# EAGLE design circuit (EAGLE 9.6.1)
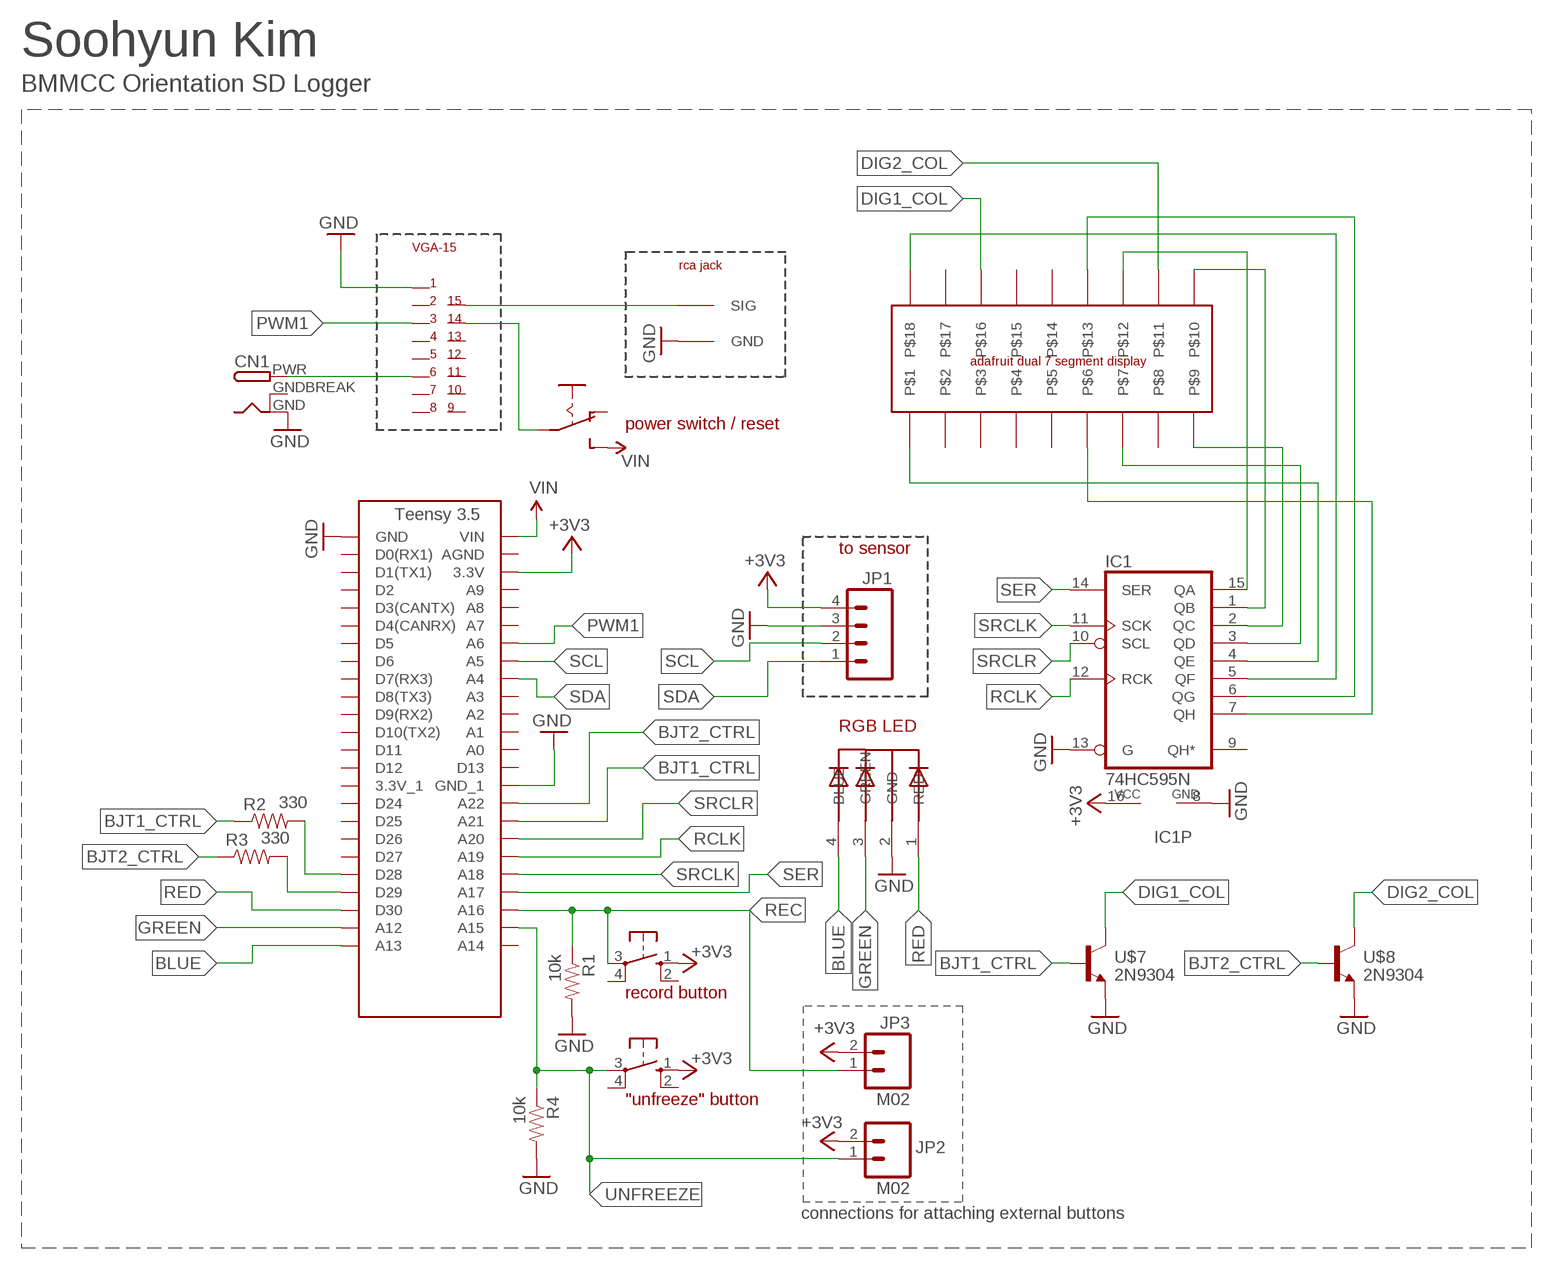
[diagram p0: schematic, sheet 1]

## Parts
CN1  DCBARRELPTH  [DCJACK_2MM_PTH]
IC1  74HC595N  [DIL16]
JP1  M04  [1X04]
JP2  M02  [1X02]
JP3  M02  [1X02]
R1  10k  RESISTORPTH-1/4W  [AXIAL-0.4]
R2  330  RESISTORPTH-1/4W  [AXIAL-0.4]
R3  330  RESISTORPTH-1/4W  [AXIAL-0.4]
R4  10k  RESISTORPTH-1/4W  [AXIAL-0.4]
S3  40-XX  [B3F-40XX]
S4  40-XX  [B3F-40XX]
U$1  TEENSY_3.5  [TEENSY_3.5_SIMPLE]
U$2  VGA-15  [VGA-15]
U$3  RCA  [RCA]
U$4  LED_5MM_RGB  [LED_5MM_RGB]
U$5  SLIDE_SWITCH  [SLIDE_SWITCH]
U$6  DUAL_7SEG_DISPLAY  [DUAL_7SEG_DISPLAY]
U$7  2N9304  [TO92]
U$8  2N9304  [TO92]

## Nets
+3V3: IC1.16(VCC) JP1.4 JP2.2 JP3.2 S3.1(S) S4.1(S) U$1.3.3V
BJT1_CTRL: R2.P$1 U$1.A21 U$7.2(BASE)
BJT2_CTRL: R3.P$1 U$1.A22 U$8.2(BASE)
BLUE: U$1.A13 U$4.4(BLUE)
D28: R2.P$2 U$1.D28
D29: R3.P$2 U$1.D29
DIG1_COL: U$6.16 U$7.1(COLLECTOR)
DIG2_COL: U$6.11 U$8.1(COLLECTOR)
GND: CN1.GND IC1.8(GND) IC1.13(G) JP1.3 R1.P$2 R4.P$2 U$1.GND U$1.GND_1 U$2.1 U$3.GND U$4.2(GND) U$7.3(EMITTER) U$8.3(EMITTER)
GREEN: U$1.A12 U$4.3(GREEN)
N$1: IC1.4(QE) U$6.1
N$2: U$2.14 U$5.P$2(P)
N$3: IC1.1(QB) U$6.10
N$4: IC1.2(QC) U$6.9
N$5: U$2.15 U$3.SIG
N$6: CN1.PWR U$2.6
N$7: IC1.3(QD) U$6.7
N$8: IC1.15(QA) U$6.12
N$9: IC1.5(QF) U$6.18
N$10: IC1.6(QG) U$6.13
N$11: IC1.7(QH) U$6.6
PWM1: U$1.A6 U$2.3
RCLK: IC1.12(RCK) U$1.A19
REC: JP3.1 R1.P$1 S3.3(P) U$1.A16
RED: U$1.D30 U$4.1(RED)
SCL: JP1.2 U$1.A5
SDA: JP1.1 U$1.A4
SER: IC1.14(SER) U$1.A17
SRCLK: IC1.11(SCK) U$1.A18
SRCLR: IC1.10(SCL) U$1.A20
UNFREEZE: JP2.1 R4.P$1 S4.3(P) U$1.A15
VIN: U$1.VIN U$5.P$3(S)
Unconnected: IC1.9(QH*) S3.2(S1) S3.4(P1) S4.2(S1) S4.4(P1) U$1.3.3V_1 U$1.A0 U$1.A1 U$1.A2 U$1.A3 U$1.A7 U$1.A8 U$1.A9 U$1.A14 U$1.AGND U$1.D0(RX1) U$1.D1(TX1) U$1.D2 U$1.D3(CANTX) U$1.D4(CANRX) U$1.D5 U$1.D6 U$1.D7(RX3) U$1.D8(TX3) U$1.D9(RX2) U$1.D10(TX2) U$1.D11 U$1.D12 U$1.D13 U$1.D24 U$1.D25 U$1.D26 U$1.D27 U$2.2 U$2.4 U$2.5 U$2.7 U$2.8 U$2.9 U$2.10 U$2.11 U$2.12 U$2.13 U$5.P$1(O) U$6.2 U$6.3 U$6.4 U$6.5 U$6.8 U$6.14 U$6.15 U$6.17

## Notes on the sheet
- Soohyun Kim
- BMMCC Orientation SD Logger
- power switch / reset
- to sensor
- RGB LED
- record button
- "unfreeze" button
- connections for attaching external buttons

## Power pins joined to a net without a drawn wire
GNDBREAK: CN1.GNDBREAK

## Library data of the parts
CN1 = HyTechDevices:DCBARREL: 2.0mm DC Barrel Jack DCJACK_2MM_PTH - Through Hole Jack (4UConnector: 05537) Source: Adafruit <https://github.com/adafruit/Adafruit-Eagle-Library>
IC1 = 74xx-eu:74*595: 8-bit SHIFT REGISTER, output latch
JP1 = HyTechDevices:M04: Standard 4-pin 0.1" header. NOTES ON THE VARIANTS LOCK and LOCK_LONGPADS... This footprint was designed to help hold the alignment of a through-hole component (i.e. 6-pin header) while soldering it into place. You may notice that each hole has been shifted either up or down by 0.005 of an inch from it's more standard position (which is a perfectly straight line). This slight alteration caused the pins (the squares in the middle) to touch the edges of the holes. Because they are alternating, it causes a "brace" to hold the component in place. 0.005 has proven to be the perfect amount of "off-center" position when using our standard breakaway headers. Although looks a little odd when you look at the bare footprint, once you have a header in there, the alteration is very hard to notice. Also,if you push a header all the way into place, it is covered up entirely on the bottom side. This idea of altering the position of holes to aid alignment will be further integrated into the Sparkfun Library for other footprints. It can help hold any component with 3 or more connection pins. Note: The Sparkfun version includes many other packages including surface mount that may be of future interest. Source: Sparkfun <https://github.com/sparkfun/SparkFun-Eagle-Libraries>
JP2 JP3 = HyTechDevices:M02: Standard 2-pin 0.1" header. NOTES ON THE VARIANTS LOCK and LOCK_LONGPADS... This footprint was designed to help hold the alignment of a through-hole component (i.e. 6-pin header) while soldering it into place. You may notice that each hole has been shifted either up or down by 0.005 of an inch from it's more standard position (which is a perfectly straight line). This slight alteration caused the pins (the squares in the middle) to touch the edges of the holes. Because they are alternating, it causes a "brace" to hold the component in place. 0.005 has proven to be the perfect amount of "off-center" position when using our standard breakaway headers. Although looks a little odd when you look at the bare footprint, once you have a header in there, the alteration is very hard to notice. Also,if you push a header all the way into place, it is covered up entirely on the bottom side. This idea of altering the position of holes to aid alignment will be further integrated into the Sparkfun Library for other footprints. It can help hold any component with 3 or more connection pins. Note: The Sparkfun version includes many other packages including surface mount that may be of future interest. Source: Sparkfun <https://github.com/sparkfun/SparkFun-Eagle-Libraries>
R1-R4 = HyTechDevices:RESISTOR: Resistor Basic schematic elements and footprints for 0603, 1206, and PTH resistors.
S3 S4 = switch-omron:40-XX: OMRON SWITCH; MF: OMRON COMPONENTS USA; MPN: B3F-4000; OC_FARNELL: 176434; OC_NEWARK: 36K3105
U$1 = HyTechDevices:TEENSY_3.5
U$2 = HyTechDevices:VGA-15
U$3 = HyTechDevices:RCA
U$4 = HyTechDevices:LED_5MM_RGB: Source: Adafruit <https://github.com/adafruit/Adafruit-Eagle-Library>
U$5 = HyTechDevices:SLIDE_SWITCH
U$6 = HyTechDevices:DUAL_7SEG_DISPLAY
U$7 U$8 = HyTechDevices:2N9304

## Board
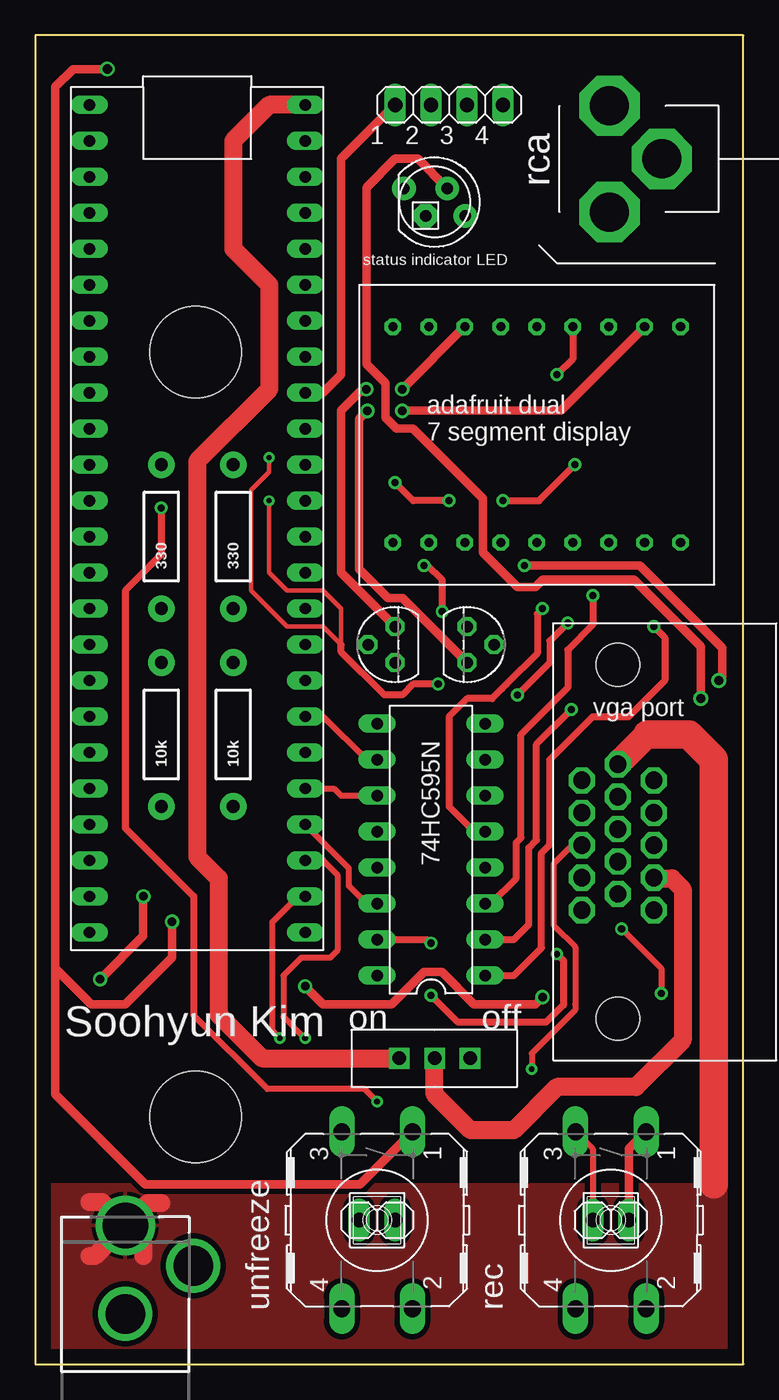
[diagram p1: board, top side]
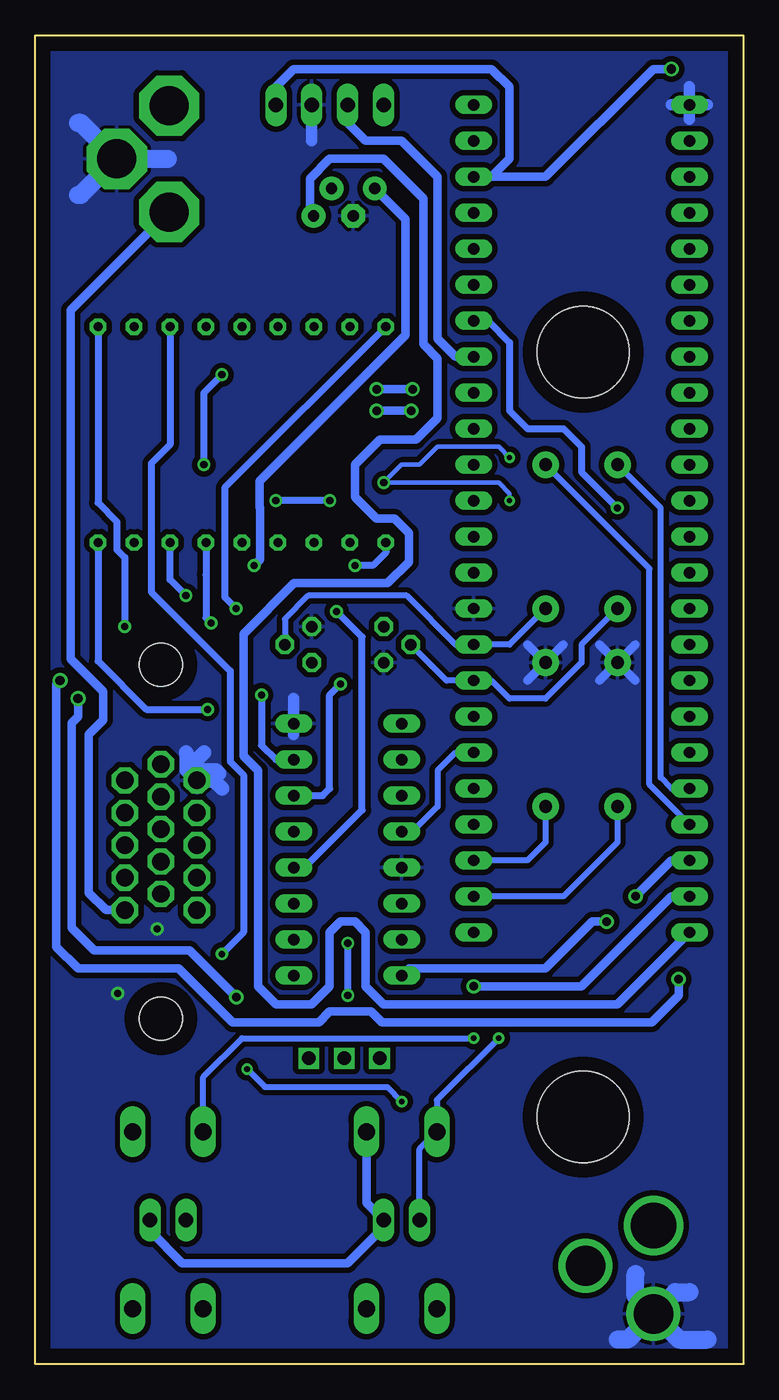
[diagram p2: board, bottom side, seen from below]

Size 50 x 93.81 mm. Coordinates in mm from the lower left corner, seen from the top.
Outline: 0,0 50,0 50,93.81 0,93.81 0,0
Copper layers (1*16): Top 0.035mm / dielectric 1.5mm / Bottom 0.035mm
Design rules "default *": minimum track width 6mil, minimum drill 0.35mm, track to track 15mil, track to pad 15mil, pad to pad 15mil, via to via 15mil, smd to smd 15mil, copper to edge 40mil, drill to drill 6mil, minimum pad ring 10mil, minimum via ring 8mil, stop-mask expansion 4mil, vias tented up to drill 0mil, thermal gap 10mil
Holes 6.48 mm at 11.32,71.45 11.32,17.45

### Footprints (pad centres in the part's own frame; a part is rotated, then mirrored left to right if it is on the bottom)
DCJACK_2MM_PTH = drill 2.8: GND 0,7.35; GNDBREAK 4.8,10.75 | drill 3.2: PWR 0,13.6
DIL16 = drill 0.813 long: 1 -8.89,-3.81; 2 -6.35,-3.81; 3 -3.81,-3.81; 4 -1.27,-3.81; 5 1.27,-3.81; 6 3.81,-3.81; 7 6.35,-3.81; 8 8.89,-3.81; 9 8.89,3.81; 10 6.35,3.81; 11 3.81,3.81; 12 1.27,3.81; 13 -1.27,3.81; 14 -3.81,3.81; 15 -6.35,3.81; 16 -8.89,3.81
1X04 = drill 1.016 long: 1 -3.81,0; 2 -1.27,0; 3 1.27,0; 4 3.81,0
1X02 = drill 1.016 long: 1 -1.27,0; 2 1.27,0
AXIAL-0.4 = drill 0.9 pad 1.88: P$1 -5.08,0; P$2 5.08,0
B3F-40XX = drill 1.194 long: 1 -6.248,2.489; 2 6.248,2.489; 3 -6.248,-2.489; 4 6.248,-2.489
TEENSY_3.5_SIMPLE = drill 0.8 long: 3.3V 16.51,54.61; 3.3V_1 1.27,24.13; A0 16.51,29.21; A1 16.51,31.75; A2 16.51,34.29; A3 16.51,36.83; A4 16.51,39.37; A5 16.51,41.91; A6 16.51,44.45; A7 16.51,46.99; A8 16.51,49.53; A9 16.51,52.07; A12 1.27,3.81; A13 1.27,1.27; A14 16.51,1.27; A15 16.51,3.81; A16 16.51,6.35; A17 16.51,8.89; A18 16.51,11.43; A19 16.51,13.97; A20 16.51,16.51; A21 16.51,19.05; A22 16.51,21.59; AGND 16.51,57.15; D0(RX1) 1.27,57.15; D1(TX1) 1.27,54.61; D2 1.27,52.07; D3(CANTX) 1.27,49.53; D4(CANRX) 1.27,46.99; D5 1.27,44.45; D6 1.27,41.91; D7(RX3) 1.27,39.37; D8(TX3) 1.27,36.83; D9(RX2) 1.27,34.29; D10(TX2) 1.27,31.75; D11 1.27,29.21; D12 1.27,26.67; D13 16.51,26.67; D24 1.27,21.59; D25 1.27,19.05; D26 1.27,16.51; D27 1.27,13.97; D28 1.27,11.43; D29 1.27,8.89; D30 1.27,6.35; GND 1.27,59.69; GND_1 16.51,24.13; VIN 16.51,59.69
VGA-15 = drill 1.23 octagon: 1 16.829,2.554; 2 14.539,2.554; 3 12.249,2.554; 4 9.959,2.554; 5 7.669,2.554; 6 17.969,0.014; 7 15.679,0.014; 8 13.389,0.014; 9 11.099,0.014; 10 8.809,0.014; 11 16.829,-2.526; 12 14.539,-2.526; 13 12.249,-2.526; 14 9.959,-2.526; 15 7.669,-2.526 | hole 3.07: 24.994,0.014; 0.004,0.014
RCA = drill 2.75 pad 4.25 octagon: GND 0,4.013; P$2 3.75,7.713; SIG -3.75,7.713
LED_5MM_RGB = drill 0.8 pad 1.676: 1 -2.159,0.968; 3 0.889,0.968; 4 2.159,-0.968 | drill 0.8 pad 1.676 octagon: 2 -0.635,-0.968
SLIDE_SWITCH = drill 0.95 square: P$1 -2.5,0; P$2 0,0; P$3 2.5,0
DUAL_7SEG_DISPLAY = drill 0.65 octagon: 1 2.39,-18.195; 2 4.93,-18.195; 3 7.47,-18.195; 4 10.01,-18.195; 5 12.55,-18.195; 6 15.09,-18.195; 7 17.63,-18.195; 8 20.17,-18.195; 9 22.71,-18.195; 10 22.71,-2.955; 11 20.17,-2.955; 12 17.63,-2.955; 13 15.09,-2.955; 14 12.55,-2.955; 15 10.01,-2.955; 16 7.47,-2.955; 17 4.93,-2.955; 18 2.39,-2.955
TO92 = drill 0.813 octagon: 1 1.27,0; 2 0,1.905; 3 -1.27,0

### Placement (x,y rotation side)
CN1  6.35,-3.81 0 top
IC1  27.94,36.32 90 top
JP1  29.21,88.9 0 top
JP2  24.13,10.16 0 top
JP3  40.64,10.16 0 top
R1  13.97,44.45 90 top
R2  8.89,58.42 90 top
R3  13.97,58.42 90 top
R4  8.89,44.45 90 top
S3  40.64,10.16 270 top
S4  24.13,10.16 270 top
U$1  2.54,29.21 0 top
U$2  41.15,24.38 90 top
U$3  48.26,85.09 90 top
U$4  28.19,82.04 0 top
U$5  28.19,21.59 180 top
U$6  22.86,76.2 0 top
U$7  25.4,50.8 90 top
U$8  30.48,50.8 270 top

### Tracks (layer width: path | path; a pad name or v marks a point on that pad's centre or on a via)
+3V3  (via drill 0.6, 0.65)
  Top 0.61: 1.4,27.94 1.4,19.05 7.75,12.7 22.91,12.7 S4.1 | 1.4,27.94 1.4,90.17 2.67,91.44 v5.08,91.44 | 1.4,27.94 3.94,25.4 6.35,25.4 9.65,28.7 v9.65,31.24 | JP3.2 41.91,15.19 S3.1
  Bottom 0.61: JP1.4 33.02,90.17 31.75,91.44 17.78,91.44 16.51,90.17 16.51,85.09 17.78,83.82 U$1.3.3V 13.97,83.82 6.35,91.44 v5.08,91.44 | IC1.16 23.62,27.94 13.97,27.94 10.67,31.24 v9.65,31.24 | JP3.2 41.91,9.4 39.62,7.11 27.94,7.11 25.4,9.65 JP2.2 26.62,11.38 S4.1
BJT1_CTRL
  Bottom 0.406: R2.P$1 11.43,50.8 11.43,49.53 13.97,46.99 16.51,46.99 17.78,48.26 U$1.A21 20.95,48.26 U$7.2
BJT2_CTRL
  Bottom 0.406: R3.P$1 16.51,50.8 U$1.A22 20.32,50.8 23.77,54.25 30.73,54.25 32.38,52.6 U$8.2
BLUE
  Bottom 0.61: U$1.A13 8.89,25.4 25.4,25.4 26.67,26.67 26.67,30.48 27.43,31.24 28.45,31.24 29.21,30.48 29.21,26.67 30.48,25.4 33.02,25.4 34.29,26.67 34.29,41.91 35.31,42.93 35.31,51.56 31.73,55.14 25.12,55.14 23.62,56.64 23.62,58.67 24.64,59.69 25.91,59.69 27.43,61.21 27.43,63.5 25.65,65.28 23.11,65.28 21.59,66.8 21.59,70.99 22.61,72 22.61,82.3 25.4,85.09 27.94,85.09 28.39,85.09 29.21,85.09 30.61,83.69 30.61,81.33 U$4.4
D28
  Bottom 0.406: U$1.D28 5.08,40.64 5.84,41.4 5.84,60.45 R2.P$2
D29
  Bottom 0.406: U$1.D29 6.63,40.92 6.63,56.16 R3.P$2
DIG1_COL  (via drill 0.6)
  Top 0.61: U$7.1 21.59,55.88 21.59,67.31 23.11,68.83 v23.37,68.83 | U$6.16 30.32,73.25 v25.91,68.83
  Bottom 0.61: v23.37,68.83 v25.91,68.83
DIG2_COL  (via drill 0.6)
  Top 0.61: U$6.11 37.09,67.31 v25.91,67.31 | v23.45,67.31 22.86,66.72 22.86,56.13 24.89,54.1 25.4,54.1 25.65,54.1 25.91,54.1 U$8.1
  Bottom 0.61: v25.91,67.31 v23.45,67.31
GND  (via drill 0.5)
  Top 0.406: v41.4,30.73 44.2,27.94 v44.2,26.16
  Bottom 0.61: R4.P$2 10.16,48.26 | R4.P$2 7.62,48.26 | R4.P$2 7.62,50.8 | R4.P$2 10.16,50.8 | R1.P$2 12.7,50.8 | R1.P$2 15.24,50.8 | R1.P$2 15.24,48.26
  Bottom 0.813: U$1.GND 3.81,90.17 | U$1.GND 5.08,88.9 | U$1.GND 2.54,88.9 | JP1.3 30.48,86.36 | 31.75,46.99 IC1.8 31.75,44.45 | U$1.GND 3.81,87.88
  Bottom 1.016: U$2.1 38.59,42.69 38.1,43.18 | U$2.1 37.4,41.21 36.83,40.64 | U$2.1 38.1,41.71 38.1,41.91 37.22,41.91 37.03,41.71 | U$2.1 39.32,41.94 39.32,43.1 39.37,43.15 39.37,43.18
  Bottom 1.27: CN1.GND 4.81,5.08 3.81,5.08 | CN1.GND 8.16,1.73 8.89,1.73 | CN1.GND 4.54,1.73 2.54,1.73 | CN1.GND 7.62,4.81 7.62,6.35 | U$3.GND 46.79,87.63 46.99,87.63 | U$3.GND 46.79,82.55 46.99,82.55 | U$3.GND 40.64,85.09
  pour Bottom: -1.27,93.98 50.8,93.98 50.8,-1.27 -1.27,-1.27
GREEN  (via drill 0.6, 0.65)
  Top 0.61: v19.05,26.67 20.32,25.4 25.15,25.4 27.43,27.69 28.7,27.69 30.99,25.4 35.31,25.4 v35.81,25.91 | v46.99,46.99 46.99,50.67 42.26,55.4 35.84,55.4 35.31,54.86 34.04,54.86 31.61,57.3 31.61,61.1 26.67,66.04 25.5,66.04 24.72,66.82 24.72,69.26 23.37,70.61 23.37,74.93 23.37,75.5 23.37,83.06 25.4,85.09 27,85.09 U$4.3
  Bottom 0.61: U$1.A12 5.08,33.02 11.43,26.67 v19.05,26.67 | v35.81,25.91 39.12,29.21 45.84,29.21 47.43,30.8 47.43,45.28 46.99,45.72 v46.99,46.99
N$1  (via drill 0.5)
  Top 0.5: v28.73,53.14 28.73,55.34 27.69,56.39 v27.43,56.39
  Bottom 0.5: IC1.4 30.99,35.05 26.92,39.12 26.92,51.34 v28.73,53.14 | U$6.1 25.25,57.3 26.16,56.39 v27.43,56.39
N$2
  Top 1.27: U$2.14 43.73,34.29 44.96,34.29 45.72,33.53 45.72,22.86 42.42,19.56 36.83,19.56 33.78,16.51 30.73,16.51 28.19,19.05 U$5.P$2
N$3  (via drill 0.5)
  Top 0.508: IC1.1 33.78,27.43 35.74,29.39 35.74,36.09 36.32,36.67 36.32,42.67 39.37,45.72 41.91,45.72 44.45,48.26 44.45,51.31 v43.69,52.07
  Bottom 0.508: U$6.10 45.57,60.81 44.24,59.48 44.24,57.5 43.69,56.95 v43.69,52.07
N$4  (via drill 0.5)
  Top 0.508: IC1.2 33.78,29.97 34.85,31.04 34.85,36.46 35.39,37 35.39,43.77 v37.85,46.23
  Bottom 0.5: 45.57,49.63 42.16,46.23 v37.85,46.23
  Bottom 0.508: U$6.9 45.57,49.63
N$5
  Bottom 0.61: U$3.SIG 40.58,81.34 47.5,74.42 47.5,49.78 45.21,47.5 45.21,45.47 46.23,44.45 46.23,33.27 45.01,32.05 U$2.15
N$6
  Top 1.27: CN1.PWR 4.18,7.62 3.81,7.62 | CN1.PWR 7.62,8.52 7.62,7.62 | CN1.PWR 7.94,11.38 8.89,11.38 | CN1.PWR 4.71,11.43 3.81,11.43
  Top 1.8: U$2.6 43.23,44.45
  Top 2: 43.23,44.45 46.13,44.45 47.91,42.67 47.91,12.7
  pour Top: 0,12.7 0,0 49.53,0 49.53,12.7
N$7  (via drill 0.5)
  Top 0.5: 37.59,47.75 37.59,50.42 39.37,52.2 v39.37,54.26
  Top 0.508: IC1.3 32.18,32.51 33.96,34.29 33.96,36.83 34.29,37.16 34.29,44.45 37.59,47.75
  Bottom 0.508: v39.37,54.26 40.49,55.38 U$6.7
N$8  (via drill 0.45, 0.5)
  Top 0.5: IC1.15 27.69,29.97 v27.94,29.72 | v36.83,28.96 37.29,28.5 37.29,25.35 36.07,24.13 29.85,24.13 v27.94,26.04
  Bottom 0.5: U$6.12 40.49,64.92 41.82,63.59 41.82,54.52 36.24,48.94 36.24,42.54 35.31,41.6 35.31,30.48 v36.83,28.96 | v27.94,29.72 v27.94,26.04
N$9  (via drill 0.5)
  Top 0.5: v35.81,53.34 35.44,52.97 35.44,50.18 33.27,48.01 32.95,47.69 32.25,46.99 30.48,46.99 29.21,45.72 29.21,39.37 30.99,37.59 IC1.5
  Bottom 0.5: U$6.18 36.62,61.88 36.62,54.15 v35.81,53.34
N$10  (via drill 0.35, 0.5)
  Top 0.305: v16.51,60.96 16.51,55.88 17.78,54.61 20.32,54.61 21.59,53.34 21.59,50.8 20.32,52.07 17.78,52.07 15.24,54.61 15.24,61.72 16.51,62.99 v16.51,64.01
  Top 0.5: v28.45,48.01 26.67,48.01 25.91,47.24 24.64,47.24 21.59,50.29 21.59,50.8 | U$6.13 37.95,70.97 v36.83,69.85 | v29.21,60.96 26.67,60.96 v25.4,62.23 | v33.02,60.96 35.56,60.96 v38.1,63.5
  Bottom 0.305: 16.51,61.47 17.27,62.23 v25.4,62.23 24.13,63.5 22.86,63.5 21.59,64.77 17.27,64.77 v16.51,64.01
  Bottom 0.308: v16.51,60.96 16.51,61.47
  Bottom 0.5: IC1.6 29.72,40.13 29.21,40.64 29.21,47.24 v28.45,48.01 | v36.83,69.85 38.1,68.58 38.1,66.04 v38.1,63.5 | v29.21,60.96 v33.02,60.96
N$11  (via drill 0.5)
  Top 0.5: v37.59,52.32 36.32,51.05 36.32,49.53
  Top 0.508: 36.32,49.53 v34.04,47.24
  Bottom 0.5: 37.95,55.73 37.95,52.68 v37.59,52.32
  Bottom 0.508: U$6.6 37.95,55.73 | IC1.7 33.02,42.67 34.04,43.69 v34.04,47.24
PWM1  (via drill 0.4, 0.5)
  Top 0.406: U$2.3 37.9,36.63 36.62,35.35 36.62,30.94 38.12,29.44 38.12,25.4 38.12,25.01 35.05,21.93 v35.05,20.83 | 11.18,24.63 16.38,19.42 23.25,19.42 v24.13,18.54
  Top 0.5: v8.89,60.45 8.89,57.15 6.35,54.61 6.35,37.85 11.18,33.02 11.18,24.63
  Bottom 0.406: v35.05,20.83 33.78,19.56 25.15,19.56 v24.13,18.54
  Bottom 0.5: U$1.A6 18.03,73.66 16.51,72.14 16.51,67.31 15.24,66.04 12.7,66.04 11.43,64.77 11.43,62.99 v8.89,60.45
RCLK
  Bottom 0.406: U$1.A19 20.32,43.18 21.59,41.91 21.59,39.37 23.37,37.59 IC1.12
REC  (via drill 0.4)
  Top 0.406: JP3.1 39.37,15.19 S3.3 | U$1.A16 20.32,35.56 21.34,34.54 21.34,29.21 20.83,28.7 18.8,28.7 17.53,27.43 17.53,24.53 v19.05,23.01
  Bottom 0.406: R1.P$1 13.97,36.83 15.24,35.56 U$1.A16 | S3.3 38.15,20.27 35.41,23.01 v19.05,23.01
RED  (via drill 0.5, 0.6, 0.65)
  Top 0.61: v34.54,56.39 42.67,56.39 48.51,50.55 48.51,48.51 v48.26,48.26 | v7.62,33.02 7.62,30.23 v4.57,27.18
  Bottom 0.61: U$1.D30 5.08,35.56 v7.62,33.02 | v4.57,27.18 4.57,26.04 6.48,24.13 25.53,24.13 26.29,24.89 29.21,24.89 29.97,24.13 36.07,24.13 39.88,27.94 46.99,27.94 48.51,29.46 48.51,48.01 v48.26,48.26 | v34.54,56.39 34.15,56.79 34.15,60.47 34.16,60.49 34.16,62.36 23.88,72.64 23.88,80.85 U$4.1
SCL
  Bottom 0.61: JP1.2 27.94,87.63 26.67,86.36 24.13,86.36 21.59,83.82 21.59,72.39 20.32,71.12 U$1.A5
SDA
  Top 0.61: U$1.A4 20.32,68.58 21.59,69.85 21.59,85.09 JP1.1
SER
  Top 0.406: IC1.14 23.39,32.51 22.12,33.78 22.12,35.03 U$1.A17
SRCLK
  Top 0.406: U$1.A18 21.08,40.64 21.59,40.13 IC1.11
SRCLR
  Top 0.406: U$1.A20 20.32,45.72 23.37,42.67 IC1.10
UNFREEZE  (via drill 0.4)
  Top 0.406: U$1.A15 18.54,33.02 16.74,31.22 16.74,23.54 v17.27,23.01
  Bottom 0.406: R4.P$1 8.89,36.83 12.7,33.02 U$1.A15 | JP2.1 22.86,15.19 S4.3 21.64,18.64 21.41,18.87 v17.27,23.01
VIN
  Top 1.27: U$1.VIN 16.51,88.9 13.97,86.36 13.97,78.74 16.53,76.18 16.53,68.85 11.43,63.75 11.43,35.81 12.95,34.29 12.95,24.64 16,21.59 U$5.P$3

### Text on the board
tPlace: 1 2 3 4 | on | off
tNames: status indicator LED | vga port | Soohyun Kim | unfreeze | rec